# EAGLE design schemat (EAGLE 9.6.0)
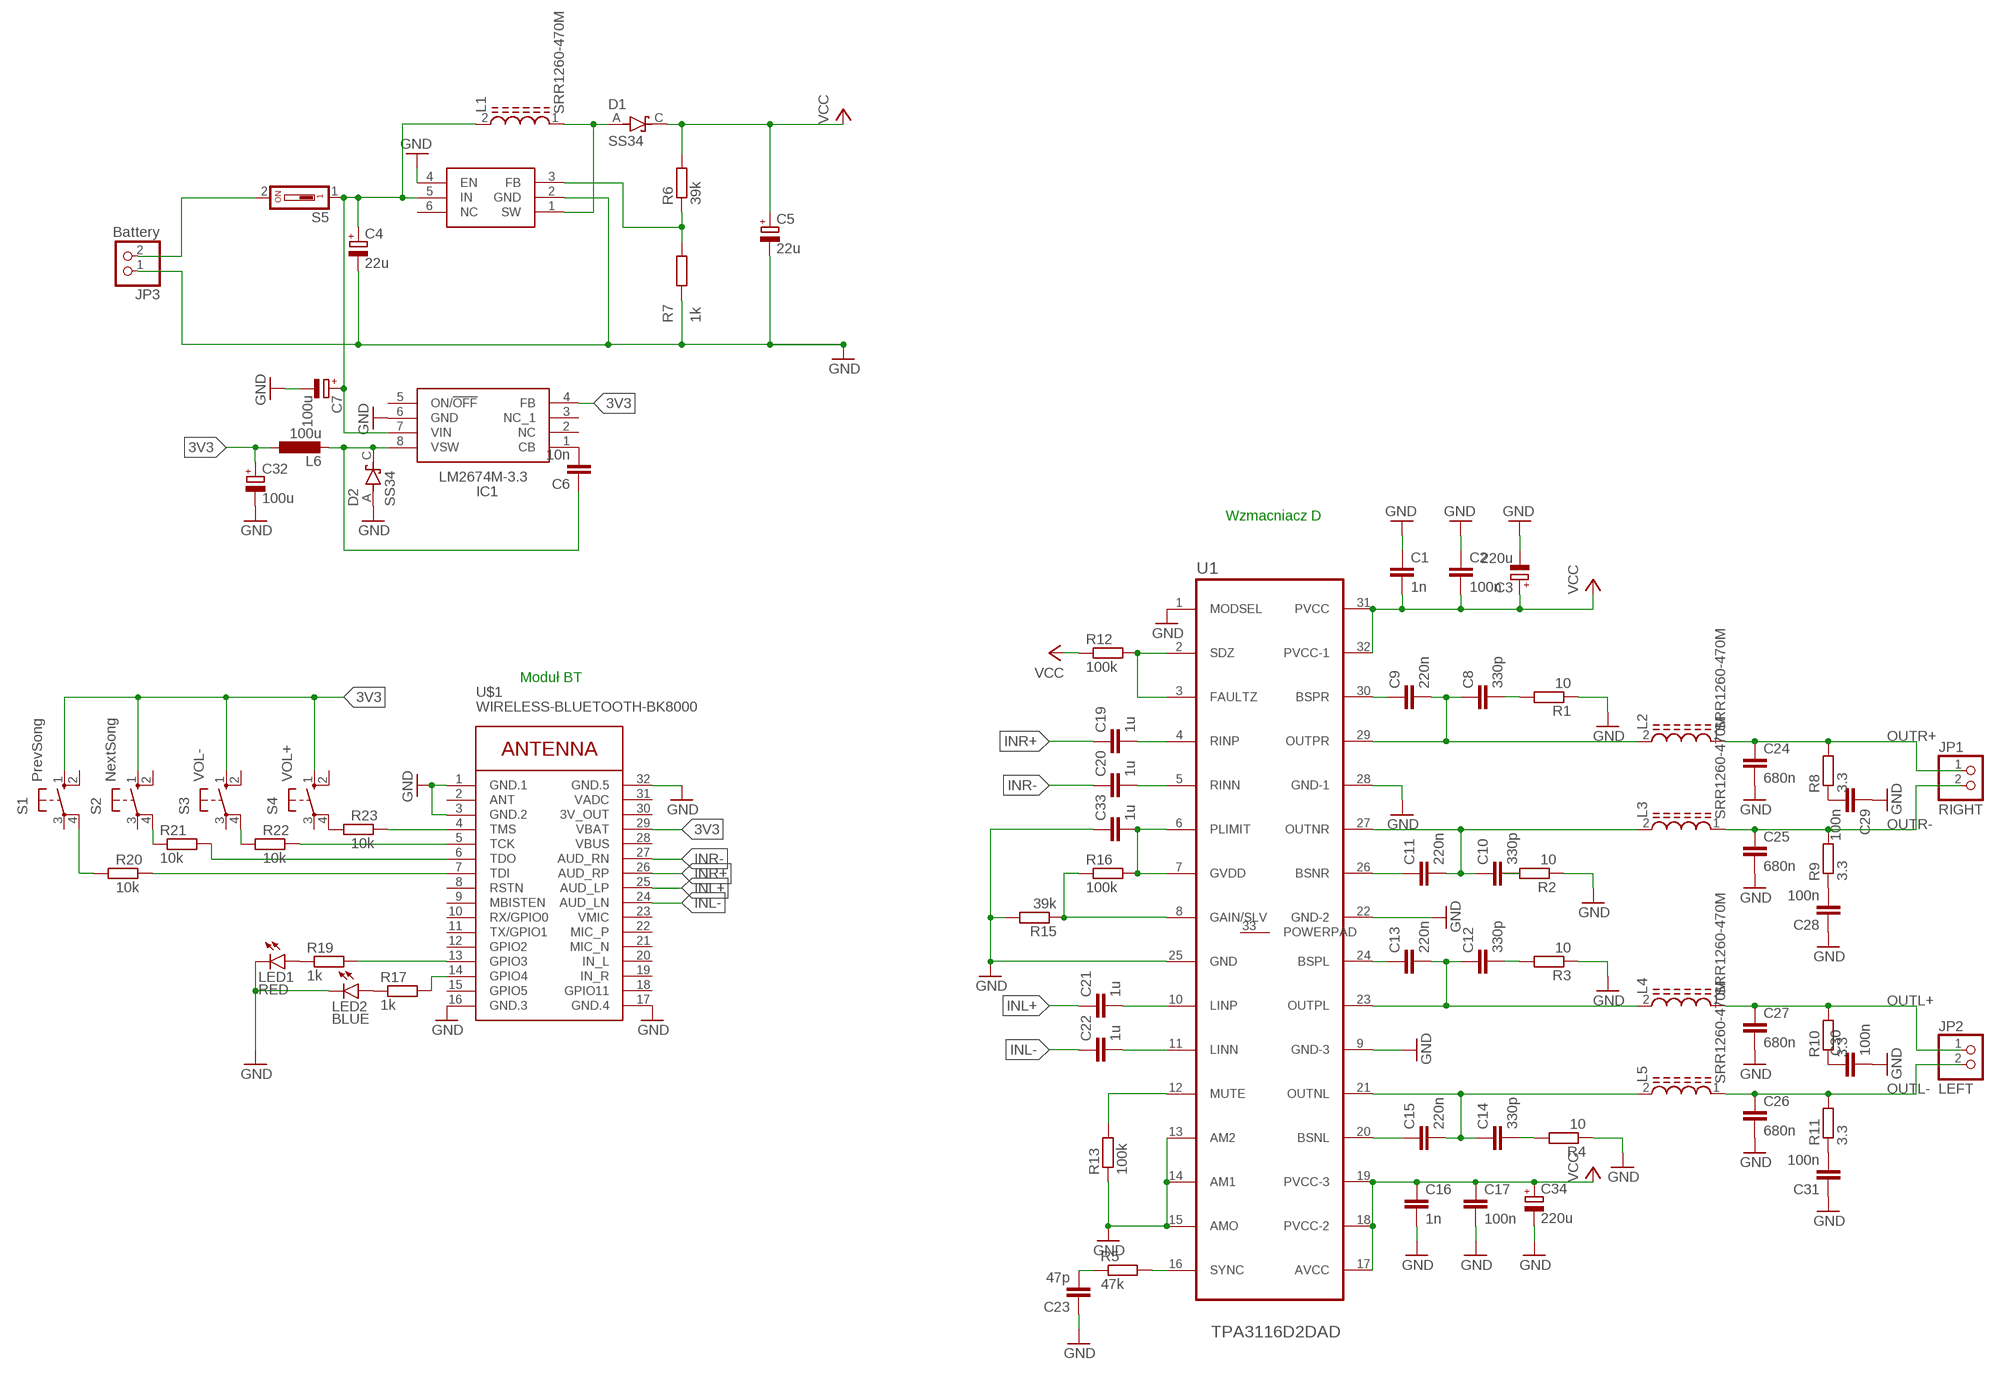
[diagram p0: schematic, sheet 1]

## Parts
C1  1n  C-EUC0805  [C0805]
C2  100n  C-EUC0805  [C0805]
C3  220u  CPOL-EU140CLH-0810  [140CLH-0810]
C4  22u  CPOL-EUD  [PANASONIC_D]
C5  22u  CPOL-EUD  [PANASONIC_D]
C6  10n  C-EUC0805  [C0805]
C7  100u  CPOL-EUD  [PANASONIC_D]
C8  330p  C-EUC0805  [C0805]
C9  220n  C-EUC0805  [C0805]
C10  330p  C-EUC0805  [C0805]
C11  220n  C-EUC0805  [C0805]
C12  330p  C-EUC0805  [C0805]
C13  220n  C-EUC0805  [C0805]
C14  330p  C-EUC0805  [C0805]
C15  220n  C-EUC0805  [C0805]
C16  1n  C-EUC0805  [C0805]
C17  100n  C-EUC0805  [C0805]
C19  1u  C-EUC0603  [C0603]
C20  1u  C-EUC0603  [C0603]
C21  1u  C-EUC0603  [C0603]
C22  1u  C-EUC0603  [C0603]
C23  47p  C-EUC0603  [C0603]
C24  680n  C-EUC1206  [C1206]
C25  680n  C-EUC1206  [C1206]
C26  680n  C-EUC1206  [C1206]
C27  680n  C-EUC1206  [C1206]
C28  100n  C-EUC0805  [C0805]
C29  100n  C-EUC0805  [C0805]
C30  100n  C-EUC0805  [C0805]
C31  100n  C-EUC0805  [C0805]
C32  100u  CPOL-EUD  [PANASONIC_D]
C33  1u  C-EUC0603  [C0603]
C34  220u  CPOL-EUD  [PANASONIC_D]
D1  SS34  [DIOM7959X265N]
D2  SS34  [DIOM7959X265N]
IC1  LM2674M-3.3  [SOIC127P600X175-8N]
JP1  RIGHT  PINHD-1X2  [1X02]
JP2  LEFT  PINHD-1X2  [1X02]
JP3  Battery  PINHD-1X2  [1X02]
L1  SRR1260-470M  [INDP125125X600N]
L2  SRR1260-470M  [INDP125125X600N]
L3  SRR1260-470M  [INDP125125X600N]
L4  SRR1260-470M  [INDP125125X600N]
L5  SRR1260-470M  [INDP125125X600N]
L6  100u  L-EUL1812  [L1812]
LED1  RED  LEDCHIP-LED0805  [CHIP-LED0805]
LED2  BLUE  LEDCHIP-LED0805  [CHIP-LED0805]
R1  10  R-EU_R0805  [R0805]
R2  10  R-EU_R0805  [R0805]
R3  10  R-EU_R0805  [R0805]
R4  10  R-EU_R0805  [R0805]
R5  47k  R-EU_R0603  [R0603]
R6  39k  R-EU_R0805  [R0805]
R7  1k  R-EU_R0805  [R0805]
R8  3.3  R-EU_R0603  [R0603]
R9  3.3  R-EU_R0603  [R0603]
R10  3.3  R-EU_R0603  [R0603]
R11  3.3  R-EU_R0603  [R0603]
R12  100k  R-EU_R0603  [R0603]
R13  100k  R-EU_R0805  [R0805]
R15  39k  R-EU_R0805  [R0805]
R16  100k  R-EU_R0805  [R0805]
R17  1k  R-EU_R0805  [R0805]
R19  1k  R-EU_R0805  [R0805]
R20  10k  R-EU_R0805  [R0805]
R21  10k  R-EU_R0805  [R0805]
R22  10k  R-EU_R0805  [R0805]
R23  10k  R-EU_R0805  [R0805]
S1  PrevSong  10-XX  [B3F-10XX]
S2  NextSong  10-XX  [B3F-10XX]
S3  VOL-  10-XX  [B3F-10XX]
S4  VOL+  10-XX  [B3F-10XX]
S5  DS01  [DS-01]
U1  TPA3116D2DAD  [SOP65P810X120-33N]
U2  MT3608  [SOT95P280X145-6N]
U$1  WIRELESS-BLUETOOTH-BK8000  [WIRELESS-BLUETOOTH-BK8000]

## Nets
3V3: C32.+ IC1.4(FB) L6.1 S1.1(S) S2.1(S) S3.1(S) S4.1(S) U$1.29(VBAT)
BAT+: C4.+ C7.+ IC1.7(VIN) L1.2 S5.1 U2.5(IN)
BAT-: C4.- C5.- JP3.1 R7.1 U2.2(GND) ; supply symbol labelled GND
GND: C1.1 C2.1 C3.- C7.- C16.2 C17.2 C23.1 C24.2 C25.2 C26.2 C27.2 C28.1 C29.1 C30.2 C31.1 C32.- C33.1 C34.- D2.A IC1.6(GND) LED1.C LED2.C R1.1 R2.1 R3.1 R4.1 R13.1 R15.2 U1.1(MODSEL) U1.9(GND-3) U1.13(AM2) U1.14(AM1) U1.15(AMO) U1.22(GND-2) U1.25(GND) U1.28(GND-1) U2.4(EN) U$1.1(GND.1) U$1.3(GND.2) U$1.16(GND.3) U$1.17(GND.4) U$1.32(GND.5)
INL+: C21.1 U$1.25(AUD_LP)
INL-: C22.1 U$1.24(AUD_LN)
INR+: C19.1 U$1.26(AUD_RP)
INR-: C20.1 U$1.27(AUD_RN)
N$1: D1.A L1.1 U2.1(SW)
N$2: C9.1 U1.30(BSPR)
N$3: C8.1 C9.2 L2.2 U1.29(OUTPR)
N$4: C12.1 C13.2 L4.2 U1.23(OUTPL)
N$5: C8.2 R1.2
N$6: C11.1 U1.26(BSNR)
N$7: C10.1 C11.2 L3.2 U1.27(OUTNR)
N$8: C10.2 R2.2
N$9: C13.1 U1.24(BSPL)
N$10: C15.1 U1.20(BSNL)
N$11: C12.2 R3.2
N$12: C14.2 R4.2
N$13: C6.1 D2.C(K) IC1.8(VSW) L6.2
N$14: R6.1 R7.2 U2.3(FB)
N$15: C19.2 U1.4(RINP)
N$16: C14.1 C15.2 L5.2 U1.21(OUTNL)
N$17: C20.2 U1.5(RINN)
N$18: C21.2 U1.10(LINP)
N$19: C22.2 U1.11(LINN)
N$20: C23.2 R5.1
N$21: R5.2 U1.16(SYNC)
N$22: R22.1 S3.4(P1)
N$23: LED2.A R17.1
N$24: LED1.A R19.1
N$25: R17.2 U$1.14(GPIO4)
N$26: C28.2 R9.1
N$27: C29.2 R8.1
N$28: C30.1 R10.1
N$29: C31.2 R11.1
N$30: R12.2 U1.2(SDZ) U1.3(FAULTZ)
N$31: R13.2 U1.12(MUTE)
N$32: C33.2 R16.2 U1.6(PLIMIT) U1.7(GVDD)
N$33: R19.2 U$1.13(GPIO3)
N$35: R15.1 R16.1 U1.8(GAIN/SLV)
N$36: C6.2 IC1.1(CB)
N$37: R21.1 S2.4(P1)
N$38: R20.2 U$1.7(TDI)
N$39: R21.2 U$1.6(TDO)
N$40: R20.1 S1.4(P1)
N$41: R23.1 S4.4(P1)
N$42: JP3.2 S5.2
N$43: R22.2 U$1.5(TCK)
N$44: R23.2 U$1.4(TMS)
OUTL+: C27.1 JP2.1 L4.1 R10.2
OUTL-: C26.1 JP2.2 L5.1 R11.2
OUTR+: C24.1 JP1.1 L2.1 R8.2
OUTR-: C25.1 JP1.2 L3.1 R9.2
VCC: C1.2 C2.2 C3.+ C5.+ C16.1 C17.1 C34.+ D1.C(K) R6.2 R12.1 U1.17(AVCC) U1.18(PVCC-2) U1.19(PVCC-3) U1.31(PVCC) U1.32(PVCC-1)
Unconnected: IC1.2(NC) IC1.3(NC_1) IC1.5(ON/!OFF) S1.2(S1) S1.3(P) S2.2(S1) S2.3(P) S3.2(S1) S3.3(P) S4.2(S1) S4.3(P) U1.33(POWERPAD) U2.6(NC) U$1.2(ANT) U$1.8(RSTN) U$1.9(MBISTEN) U$1.10(RX/GPIO0) U$1.11(TX/GPIO1) U$1.12(GPIO2) U$1.15(GPIO5) U$1.18(GPIO11) U$1.19(IN_R) U$1.20(IN_L) U$1.21(MIC_N) U$1.22(MIC_P) U$1.23(VMIC) U$1.28(VBUS)

## Notes on the sheet
- Wzmacniacz D
- Moduł BT

## Power pins joined to a net without a drawn wire
3V_OUT: U$1.30(3V_OUT)
VADC: U$1.31(VADC)

## Library data of the parts
C1 C2 C6 C8-C17 C19-C31 C33 = rcl:C-EU: CAPACITOR, European symbol; SPICEPREFIX: C
C3-C5 C7 C32 C34 = rcl:CPOL-EU: POLARIZED CAPACITOR, European symbol; SPICEPREFIX: C
D1 D2 = SS34:SS34: Diode Schottky 40V 3A 2-Pin SMC T/R; AVAILABILITY: Unavailable; DESCRIPTION: Diode Schottky 40V 3A Surface Mount SMC _DO-214AB_; MF: ON Semiconductor; MP: SS34; PACKAGE: DO-214AB-214 ON Semiconductor; PRICE: None
IC1 = LM2674M-3.3:LM2674M-3.3: Stepdown switching regulator,LM2674M-3.3 Source: Datasheet <http://www.ti.com/lit/ds/symlink/lm2674.pdf>; DESCRIPTION: Stepdown switching regulator,LM2674M-3.3; HEIGHT: 1.75mm; MANUFACTURER_NAME: Texas Instruments; MANUFACTURER_PART_NUMBER: LM2674M-3.3; MOUSER_PART_NUMBER: 926-LM2674M-33; MOUSER_PRICE-STOCK: https://www.mouser.com/Search/Refine.aspx?Keyword=926-LM2674M-33; RS_PART_NUMBER: 4699418; RS_PRICE-STOCK: http://uk.rs-online.com/web/p/products/4699418
JP1-JP3 = pinhead:PINHD-1X2: PIN HEADER
L1-L5 = SRR1260-470M:SRR1260-470M: Inductor Power Shielded Wirewound 33uH 20% 100KHz 27Q-Factor Ferrite 3A 60mOhm DCR T/R; AVAILABILITY: Unavailable; DESCRIPTION: 47µH Shielded Wirewound Inductor 2.6A 86mOhm Max Nonstandard; MF: Bourns; MP: SRR1260-470M; PACKAGE: Nonstandard Bourns; PRICE: None
L6 = rcl:L-EU: INDUCTOR, European symbol; SPICEPREFIX: L
LED1 LED2 = led:LED: LED OSRAM: - CHIPLED LG R971, LG N971, LY N971, LG Q971, LY Q971, LO R971, LY R971 LH N974, LH R974 LS Q976, LO Q976, LY Q976 LO Q996 - Hyper CHIPLED LW Q18S LB Q993, LB Q99A, LB R99A - SideLED LS A670, LO A670, LY A670, LG A670, LP A670 LB A673, LV A673, LT A673, LW A673 LH A674 LY A675 LS A676, LA A676, LO A676, LY A676, LW A676 LS A679, LY A679, LG A679 - Hyper Micro SIDELED® LS Y876, LA Y876, LO Y876, LY Y876 LT Y87S - SmartLED LW L88C, LW L88S LB L89C, LB L89S, LG L890 LS L89K, LO L89K, LY L89K LS L896, LA L896, LO L896, LY L896 - TOPLED LS T670, LO T670, LY T670, LG T670, LP T670 LSG T670, LSP T670, LSY T670, LOP T670, LYG T670 LG T671, LOG T671, LSG T671 LB T673, LV T673, LT T673, LW T673 LH T674 LS T676, LA T676, LO T676, LY T676, LB T676, LH T676, LSB T676, LW T676 LB T67C, LV T67C, LT T67C, LS T67K, LO T67K, LY T67K, LW E67C LS E67B, LA E67B, LO E67B, LY E67B, LB E67C, LV E67C, LT E67C LW T67C LS T679, LY T679, LG T679 LS T770, LO T770, LY T770, LG T770, LP T770 LB T773, LV T773, LT T773, LW T773 LH T774 LS E675, LA E675, LY E675, LS T675 LS T776, LA T776, LO T776, LY T776, LB T776 LHGB T686 LT T68C, LB T68C - Hyper Mini TOPLED® LB M676 - Mini TOPLED Santana® LG M470 LS M47K, LO M47K, LY M47K Source: http://www.osram.convergy.de LUXEON: - LUMILED® LXK2-PW12-R00, LXK2-PW12-S00, LXK2-PW14-U00, LXK2-PW14-V00 LXK2-PM12-R00, LXK2-PM12-S00, LXK2-PM14-U00 LXK2-PE12-Q00, LXK2-PE12-R00, LXK2-PE12-S00, LXK2-PE14-T00, LXK2-PE14-U00 LXK2-PB12-K00, LXK2-PB12-L00, LXK2-PB12-M00, LXK2-PB14-N00, LXK2-PB14-P00, LXK2-PB14-Q00 LXK2-PR12-L00, LXK2-PR12-M00, LXK2-PR14-Q00, LXK2-PR14-R00 LXK2-PD12-Q00, LXK2-PD12-R00, LXK2-PD12-S00 LXK2-PH12-R00, LXK2-PH12-S00 LXK2-PL12-P00, LXK2-PL12-Q00, LXK2-PL12-R00 Source: www.luxeon.com KINGBRIGHT: KA-3528ASYC Source: www.kingbright.com
R1-R13 R15-R17 R19-R23 = rcl:R-EU_: RESISTOR, European symbol; SPICEPREFIX: R
S1-S4 = switch-omron:10-XX: OMRON SWITCH; MPN: B3F-1000; OC_FARNELL: 176432; OC_NEWARK: 36M3542
S5 = switch-dil:DS01: DIL/CODE SWITCH; OC_FARNELL: unknown; OC_NEWARK: unknown
U1 = TPA3116D2DAD:TPA3116D2DAD: ￼TPA3116DAD by Daniel Nugent; AVAILABILITY: Unavailable; DESCRIPTION: Amplifier IC 2-Channel _Stereo_ Class D 32-HTSSOP; MF: Texas Instruments; MP: TPA3116D2DAD; PACKAGE: HTSSOP-32 Texas Instruments; PRICE: None
U2 = MT3608:MT3608: High Efficiency 1.2MHz 2A Step Up Converter Source: Datasheet <https://www.olimex.com/Products/Breadboarding/BB-PWR-3608/resources/MT3608.pdf>; DESCRIPTION: High Efficiency 1.2MHz 2A Step Up Converter; HEIGHT: 1.45mm; MANUFACTURER_NAME: Aerosemi; MANUFACTURER_PART_NUMBER: MT3608
U$1 = diy-modules:WIRELESS-BLUETOOTH-BK8000: Bluetooth Audio Module based on BK8000L chip More details available here: http://www.electrodragon.com/w/BK8000L Click here to find device on ebay.com <http://www.ebay.com/sch/bk8000l+module>

## Board
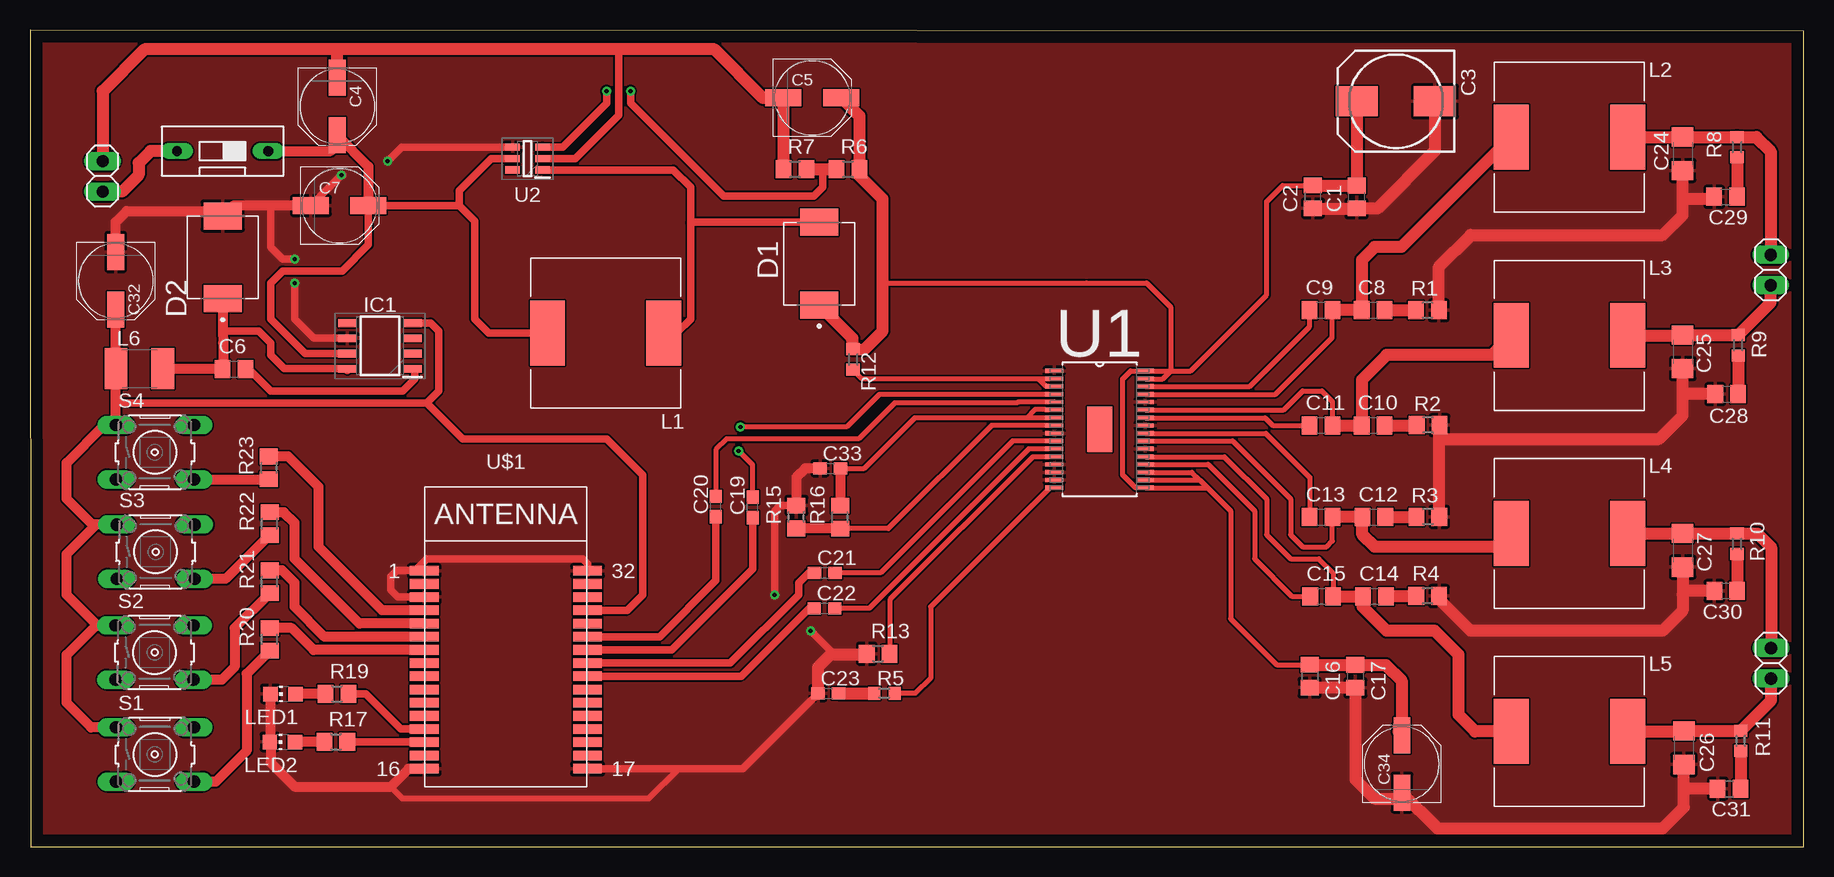
[diagram p1: board, top side]
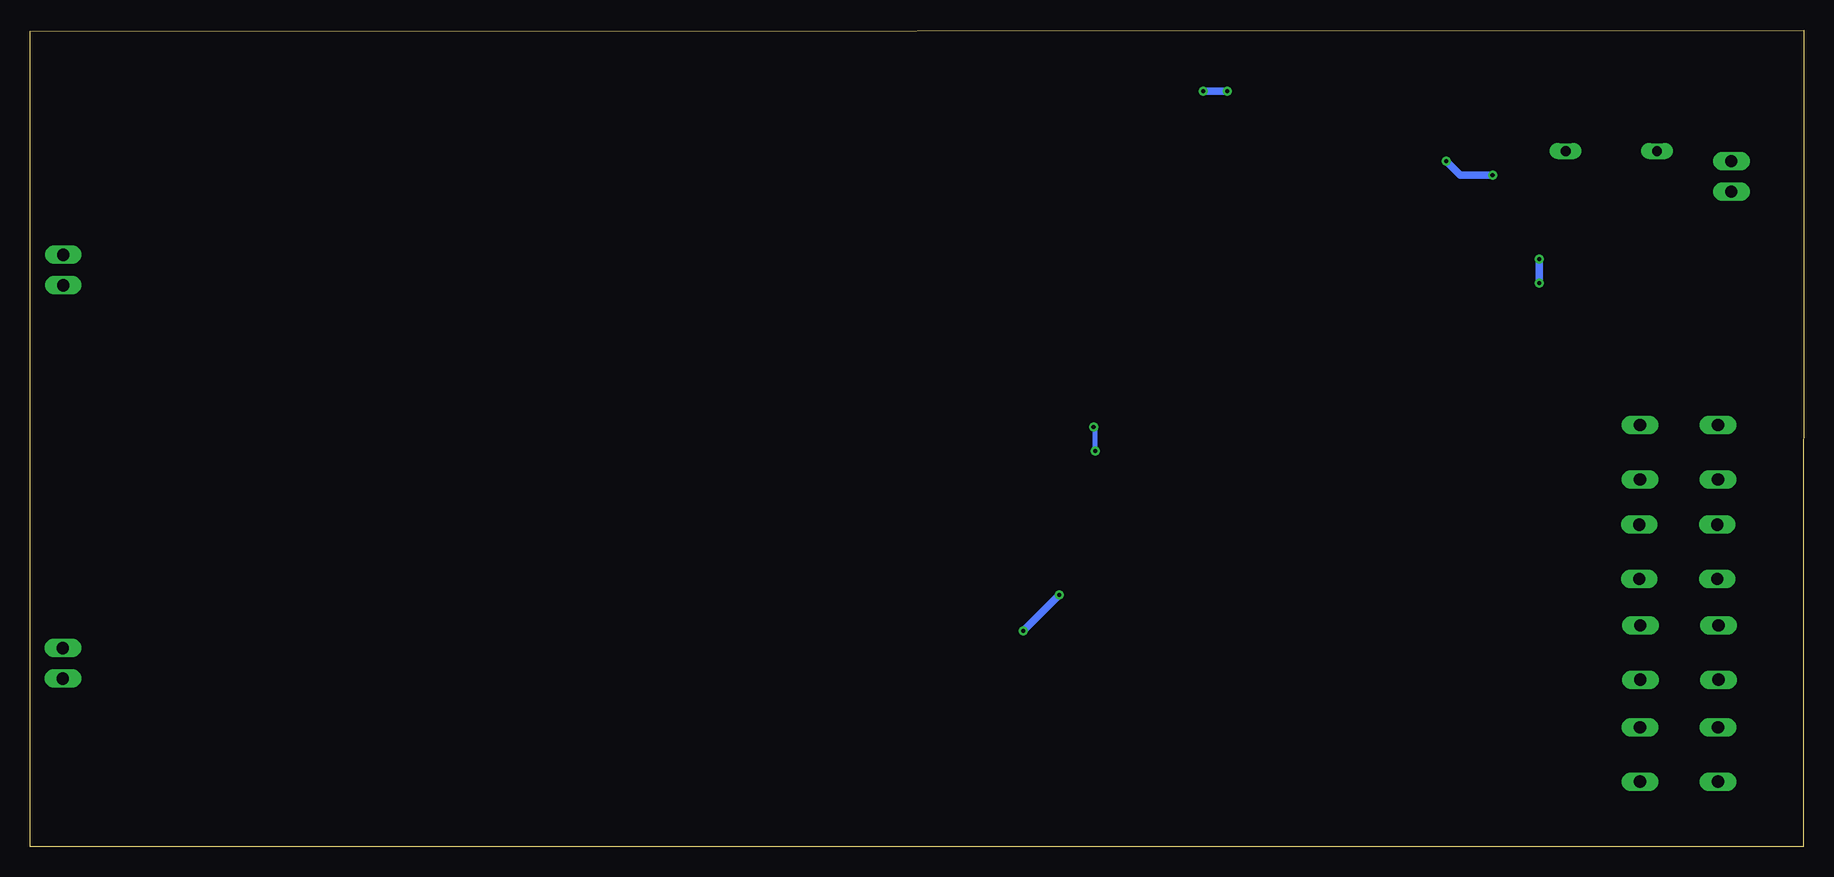
[diagram p2: board, bottom side, seen from below]

Size 147.83 x 68.1 mm. Coordinates in mm from the lower left corner, seen from the top.
Outline: 0.05,0 147.83,0 147.83,68 0,68.1 0.05,0
Copper layers (1*16): Top 0.035mm / dielectric 1.5mm / Bottom 0.035mm
Design rules "default": minimum track width 6mil, minimum drill 0.35mm, track to track 6mil, track to pad 6mil, pad to pad 6mil, via to via 6mil, smd to smd 6mil, copper to edge 40mil, drill to drill 6mil, minimum pad ring 10mil, minimum via ring 8mil, stop-mask expansion 4mil, vias tented up to drill 0mil, thermal gap 10mil

### Footprints (pad centres in the part's own frame; a part is rotated, then mirrored left to right if it is on the bottom)
C0805 = smd 1.3 x 1.5: 1 -0.95,0; 2 0.95,0
140CLH-0810 = smd 3.5 x 2.5: + 3.25,0; - -3.25,0
PANASONIC_D = smd 3 x 1.4: + 2.4,0; - -2.4,0
C0603 = smd 1.1 x 1: 1 -0.85,0; 2 0.85,0
C1206 = smd 1.6 x 1.8: 1 -1.4,0; 2 1.4,0
DIOM7959X265N = smd 2.25 x 3.18: A 3.455,0; C -3.455,0
SOIC127P600X175-8N = smd 1.525 x 0.65: 1 -2.712,1.905; 2 -2.712,0.635; 3 -2.712,-0.635; 4 -2.712,-1.905; 5 2.712,-1.905; 6 2.712,-0.635; 7 2.712,0.635; 8 2.712,1.905
1X02 = drill 1.016 long: 1 -1.27,0; 2 1.27,0
INDP125125X600N = smd 2.9 x 5.4: 1 -4.85,0; 2 4.85,0
L1812 = smd 1.9 x 3.4: 1 -1.95,0; 2 1.95,0
CHIP-LED0805 = smd 1.2 x 1.2: A 0,-1.05; C 0,1.05
R0805 = smd 1.3 x 1.5: 1 -0.95,0; 2 0.95,0
R0603 = smd 1 x 1.1: 1 -0.85,0; 2 0.85,0
B3F-10XX = drill 1.016 long: 1 -3.251,2.261; 2 3.251,2.261; 3 -3.251,-2.261; 4 3.251,-2.261
DS-01 = drill 0.813 long: 1 0,-3.81; 2 0,3.81
SOP65P810X120-33N = smd 1.473 x 0.356: 1 -3.785,4.877; 2 -3.785,4.216; 3 -3.785,3.581; 4 -3.785,2.921; 5 -3.785,2.286; 6 -3.785,1.626; 7 -3.785,0.965; 8 -3.785,0.33; 9 -3.785,-0.33; 10 -3.785,-0.965; 11 -3.785,-1.626; 12 -3.785,-2.286; 13 -3.785,-2.921; 14 -3.785,-3.581; 15 -3.785,-4.216; 16 -3.785,-4.877; 17 3.785,-4.877; 18 3.785,-4.216; 19 3.785,-3.581; 20 3.785,-2.921; 21 3.785,-2.286; 22 3.785,-1.626; 23 3.785,-0.965; 24 3.785,-0.33; 25 3.785,0.33; 26 3.785,0.965; 27 3.785,1.626; 28 3.785,2.286; 29 3.785,2.921; 30 3.785,3.581; 31 3.785,4.216; 32 3.785,4.877 | smd 2.108 x 3.81: 33 0,0
SOT95P280X145-6N = smd 1.2 x 0.6: 1 -1.25,0.95; 2 -1.25,0; 3 -1.25,-0.95; 4 1.25,-0.95; 5 1.25,0; 6 1.25,0.95
WIRELESS-BLUETOOTH-BK8000 = smd 2.4 x 0.8: 1 -6.8,5.5; 2 -6.8,4.4; 3 -6.8,3.3; 4 -6.8,2.2; 5 -6.8,1.1; 6 -6.8,0; 7 -6.8,-1.1; 8 -6.8,-2.2; 9 -6.8,-3.3; 10 -6.8,-4.4; 11 -6.8,-5.5; 12 -6.8,-6.6; 13 -6.8,-7.7; 14 -6.8,-8.8; 15 -6.8,-9.9; 16 -6.8,-11; 17 6.8,-11; 18 6.8,-9.9; 19 6.8,-8.8; 20 6.8,-7.7; 21 6.8,-6.6; 22 6.8,-5.5; 23 6.8,-4.4; 24 6.8,-3.3; 25 6.8,-2.2; 26 6.8,-1.1; 27 6.8,0; 28 6.8,1.1; 29 6.8,2.2; 30 6.8,3.3; 31 6.8,4.4; 32 6.8,5.5

### Placement (x,y rotation side)
C1  110.56,54.17 90 top
C2  106.91,54.18 90 top
C3  113.83,62.15 180 top
C4  25.6,61.72 270 top
C5  65.19,62.45 0 top
C6  17,39.84 0 top
C7  25.8,53.45 0 top
C8  111.93,44.74 0 top
C9  107.58,44.74 0 top
C10  111.93,35.14 0 top
C11  107.58,35.14 0 top
C12  111.99,27.49 0 top
C13  107.59,27.49 0 top
C14  112.04,20.89 0 top
C15  107.64,20.89 0 top
C16  106.64,14.22 270 top
C17  110.44,14.21 270 top
C19  60.21,28.29 90 top
C20  57.16,28.36 90 top
C21  66.23,22.84 0 top
C22  66.2,19.89 0 top
C23  66.52,12.79 0 top
C24  137.72,57.78 270 top
C25  137.72,41.27 270 top
C26  137.82,8.25 270 top
C27  137.72,24.71 270 top
C28  141.39,37.74 0 top
C29  141.29,54.19 0 top
C30  141.31,21.31 180 top
C31  141.59,4.84 0 top
C32  7.14,47.18 270 top
C33  66.69,31.54 0 top
C34  114.33,6.9 90 top
D1  65.76,48.62 90 top
D2  16.06,49.14 90 top
IC1  29.17,41.76 180 top
JP1  145.06,48.08 270 top
JP2  145.09,15.29 270 top
JP3  6.05,55.9 270 top
L1  47.97,42.82 180 top
L2  128.29,59.15 180 top
L3  128.29,42.64 180 top
L4  128.29,26.13 180 top
L5  128.29,9.62 180 top
L6  9.12,39.87 0 top
LED1  21.08,12.74 90 top
LED2  21.03,8.74 90 top
R1  116.46,44.73 180 top
R2  116.51,35.16 180 top
R3  116.49,27.51 180 top
R4  116.47,20.91 180 top
R5  71.2,12.79 0 top
R6  68.16,56.49 0 top
R7  63.75,56.49 0 top
R8  142.25,58.33 90 top
R9  142.35,41.82 90 top
R10  142.25,25.26 90 top
R11  142.56,8.83 90 top
R12  68.59,40.63 270 top
R13  70.68,16.09 0 top
R15  63.86,27.49 90 top
R16  67.51,27.48 90 top
R17  25.49,8.74 0 top
R19  25.59,12.74 0 top
R20  19.96,17.29 90 top
R21  19.96,22.09 90 top
R22  19.96,26.94 90 top
R23  19.91,31.59 90 top
S1  10.41,7.69 0 top
S2  10.38,16.19 0 top
S3  10.47,24.59 0 top
S4  10.41,32.89 0 top
S5  16.05,58 90 top
U1  89.14,34.8 0 top
U2  41.46,57.38 180 top
U$1  39.66,17.51 0 top

### Tracks (layer width: path | path; a pad name or v marks a point on that pad's centre or on a via)
3V3
  Top 0.61: IC1.4 33.38,43.66 34.05,43 34.05,38 33.05,37 | 33.05,37 7.16,37 | U$1.29 49.76,19.71 51.05,21 51.05,31 48.05,34 36.05,34 33.05,37
  Top 0.813: S1.1 5.1,9.95 3.05,12 3.05,16 5.55,18.5 7.08,18.5 S2.1 5.6,18.45 3.05,21 3.05,24.4 5.5,26.85 | S3.1 5.5,26.85 | 5.5,26.85 5.2,26.85 3.05,29 3.05,32 6.2,35.15 6.2,35.11 6.24,35.15 S4.1 7.16,37 L6.1 7.14,39.9 C32.+
BAT+
  Top 0.61: IC1.7 22.93,41.12 20.05,44 20.05,47 21.05,48 26,48 28.2,50.2 C7.+ 35.75,53.45 | L1.2 38.23,42.82 37.05,44 37.05,52.15 35.75,53.45 | U2.5 38.43,57.38 35.75,54.7 35.75,53.45
  Top 0.813: S5.1 25.05,58 25.6,58.55 C4.+ 28.2,56.72 C7.+
BAT-
  Top 0.61: U2.2 45.43,57.38 49.05,61 49.05,66.48
  Top 1.016: R7.1 C5.- 61.08,62.45 57.05,66.48 49.05,66.48 25.6,66.48 | C4.- 25.6,66.48 | 25.6,66.48 9.53,66.48 6.05,63 JP3.1
GND  (via drill 0.35)
  Top 0.508: 54.05,6.51 51.54,4 31.05,4 30.05,5
  Top 0.61: U$1.17 54.05,6.51 59.39,6.51 C23.1 | IC1.6 23.66,42.4 22.05,44 v22.05,47 | 20.05,53.45 20.05,50 21.05,49 v22.05,49 | R15.2 62.49,28.44 62.05,28 v62.05,21 | v65.05,18 66.7,16.35 66.7,16 | U$1.3 30.64,20.81 30.05,21.4 30.05,22.55 30.55,23.05 32,23.05 32.05,23 33.05,24 46.05,24 46.46,23.59 U$1.32 | U2.4 30.98,58.33 v29.8,57.15 | C7.- v25.95,56 26.05,56
  Top 0.813: C33.1 64.59,31.54 63.86,30.81 R15.2 | LED1.C 20.03,8.79 LED2.C 20.05,8.67 20.05,7 22.05,5 30.05,5 31.56,6.51 U$1.16 | 23.25,53.6 C7.- 20.05,53.45 16.91,53.45 D2.A 15.66,53 8.05,53 7.14,52.09 C32.-
  Top 1.016: 137.74,23.31 C27.2 137.72,21 | 137.82,6.23 C26.2 137.82,5 | C2.1 C1.1 112.27,53.22 117.08,58.03 C3.- | C16.2 C17.2 110.44,5.61 112.05,4 113.83,4 C34.- 117.31,1.52 136.05,1.52 137.82,3.29 137.82,5 | R13.1 69.64,16 66.7,16 65.65,14.95 65.65,12.81 C23.1 | 137.72,21 137.72,19.67 136.05,18 120.05,18 117.42,20.63 R4.1 | C30.2 138.03,21.31 137.72,21 | R3.1 117.44,34 | 117.44,34 117.44,35.14 R2.1 | 117.44,34 135.75,34 137.72,35.97 137.72,38 | 137.72,38 C25.2 | C28.1 137.98,37.74 137.72,38 | R1.1 117.41,48.36 120.05,51 136.05,51 137.72,52.67 137.72,54 | 137.72,54 C24.2 | C29.1 140.15,54 137.72,54 | C31.1 137.98,4.84 137.82,5
  Bottom 0.61: v62.05,21 v65.05,18 | v22.05,49 v22.05,47 | v29.8,57.15 28.65,56 v25.95,56
  pour Top: 0.05,68 148.05,68 148.05,0 0.05,0
INL+
  Top 0.61: U$1.25 58.36,15.31 64.05,21 64.05,22 64.89,22.84 C21.1
INL-
  Top 0.61: U$1.24 59.26,14.21 64.94,19.89 C22.1
INR+
  Top 0.61: U$1.26 53.46,16.41 60.21,23.16 C19.1
INR-
  Top 0.61: U$1.27 52.46,17.51 57.16,22.21 C20.1 57.05,27.4
N$1
  Top 0.61: 65.41,52.43 D1.A 55.12,52.08 55.05,52 | U2.1 53.62,56.43 55.05,55 55.05,52 | L1.1 53.87,42.82 55.05,44 55.05,52
N$2
  Top 0.406: U1.30 101.63,38.38 106.63,43.38 C9.1
N$3
  Top 0.406: U1.29 103.77,37.72 108.5,42.45 108.5,44.71 C9.2
  Top 1.016: L2.2 114.29,50 112.05,50 110.98,48.93 C8.1 C9.2
N$4
  Top 0.406: U1.23 100.22,33.84 105.05,29 105.05,26 106.05,25 108.05,25 108.54,25.49 C13.2
  Top 1.016: L4.2 122.31,25 112.05,25 111.04,26.01 C12.1 C13.2
N$5
  Top 1.016: C8.2 R1.2
N$6
  Top 0.406: U1.26 102.94,35.77 103.56,35.14 C11.1
N$7
  Top 0.406: U1.27 104.48,36.43 106.05,38 107.65,38 108.53,37.12 C11.2
  Top 1.016: L3.2 121.8,41 113.05,41 110.98,38.93 C10.1 C11.2
N$8
  Top 1.016: C10.2 115.54,35.14 R2.2
N$9
  Top 0.406: U1.24 102.98,34.47 106.65,30.8 C13.1
N$10
  Top 0.406: U1.20 98.17,31.88 102.05,28 102.05,24 105.16,20.89 C15.1
N$11
  Top 1.016: C12.2 115.52,27.49 R3.2
N$12
  Top 1.016: C14.2 113.01,20.91 R4.2
N$13
  Top 0.61: 26.46,39.71 IC1.8 21.2,39.85 20.05,41 20.05,42 19.05,43 16.08,43
  Top 0.813: L6.2 16.02,39.87 | 16.02,39.87 C6.1 | D2.C 16.08,43 16.09,42 16.09,39.94 16.02,39.87
N$14  (via drill 0.35)
  Top 0.61: 66.05,56.49 66.05,55 65.3,54.25 57.8,54.25 50.05,62 v50.05,63 | U2.3 44.38,58.33 48.05,62 v48.05,63
  Top 1.016: R7.2 66.05,56.49 R6.1
  Bottom 0.61: v48.05,63 v50.05,63
N$15  (via drill 0.35)
  Top 0.406: U1.4 70.77,37.72 68.05,35 v59.2,35 | C19.2 60.21,31.84 v59.05,33
  Bottom 0.406: v59.05,33 59.05,34.85 v59.2,35
N$16
  Top 0.406: U1.21 99.54,32.51 103.05,29 103.05,26 105.05,24 107.4,24 108.59,22.81 C15.2
  Top 1.016: L5.2 120.43,9.62 119.05,11 119.05,16 117.05,18 113.05,18 111.05,20 111.05,20.85 | 111.05,20.85 C14.1 | C15.2 111.01,20.89 111.05,20.85
N$17
  Top 0.406: U1.5 82.36,37.09 82.27,37 72.05,37 69.05,34 58.05,34 57.16,33.11 C20.2
N$18
  Top 0.406: U1.10 81.88,33.84 70.89,22.84 C21.2
N$19
  Top 0.406: U1.11 83.22,33.17 69.94,19.89 C22.2
N$20
  Top 1.016: C23.2 R5.1
N$21
  Top 0.406: U1.16 84.97,29.92 75.05,20 75.05,14.05 73.79,12.79 R5.2
N$22
  Top 0.813: R22.1 16.3,22.33 S3.4
N$23
  Top 0.813: R17.1 LED2.A
N$24
  Top 0.813: R19.1 LED1.A
N$25
  Top 0.61: R17.2 32.83,8.74 U$1.14
N$26
  Top 1.016: R9.1 C28.2
N$27
  Top 1.016: R8.1 C29.2
N$28
  Top 1.016: R10.1 C30.1
N$29
  Top 1.016: R11.1 142.56,4.86 C31.2
N$30
  Top 0.406: U1.2 84.05,39.02 | 84.05,39.02 69.35,39.02 R12.2 | U1.3 84.69,38.38 84.05,39.02
N$31
  Top 0.406: U1.12 83.56,32.51 71.65,20.6 71.65,16.11 R13.2
N$32
  Top 0.406: U1.7 83.05,35.77 | 83.05,35.77 73.72,35.77 69.46,31.51 67.51,31.51 | U1.6 84.62,36.43 84.61,36.44 83.73,36.44 83.05,35.77
  Top 0.813: C33.2 67.51,31.51 R16.2
N$33
  Top 0.61: U$1.13 30.89,9.81 27.96,12.74 R19.2
N$35
  Top 0.406: U1.8 80.13,35.13 71.53,26.53 R16.1
  Top 0.813: R16.1 R15.1
N$36
  Top 0.61: C6.2 18.21,39.84 20.05,38 31.05,38 32.05,39 32.05,39.69 IC1.1
N$37
  Top 0.813: R21.1 17.05,18.23 17.05,15 15.98,13.93 S2.4
N$38
  Top 0.813: U$1.7 23.64,16.41 21.81,18.24 R20.2
N$39
  Top 0.813: U$1.6 24.54,17.51 22.05,20 22.05,22 21.01,23.04 R21.2
N$40
  Top 0.813: R20.1 18.05,14.43 18.05,8 15.48,5.43 S1.4
N$41
  Top 0.813: S4.4 19.9,30.63 R23.1
N$42
  Top 1.016: S5.2 10.05,58 9.05,57 9.05,56 7.68,54.63 JP3.2
N$43
  Top 0.813: U$1.5 27.44,18.61 22.05,24 22.05,27 21.16,27.89 R22.2
N$44
  Top 0.813: U$1.4 29.34,19.71 24.05,25 24.05,30 21.51,32.54 R23.2
OUTL+
  Top 1.016: L4.1 137.7,26.13 C27.1 R10.2 143.94,26.11 145.09,24.96 JP2.1
OUTL-
  Top 1.016: L5.1 137.79,9.62 C26.1 137.85,9.68 R11.2 145.09,12.21 JP2.2
OUTR+
  Top 1.016: L2.1 137.69,59.15 C24.1 R8.2 143.87,59.18 145.06,57.99 JP1.1
OUTR-
  Top 1.016: L3.1 137.69,42.64 C25.1 R9.2 145.06,45.38 JP1.2
VCC
  Top 0.406: 95.05,39.68 93.05,39.68 U1.32 91.73,39.68 91.05,39 91.05,31 92.13,29.92 U1.17 98.13,29.92 | 95.05,39.68 96.73,39.68 103.05,46 103.05,53.8 104.38,55.13 C2.2 | 98.13,29.92 100.05,28 100.05,19 103.88,15.17 C16.1 | U1.31 94.39,39.02 95.05,39.68 | U1.19 96.83,31.22 97.47,30.58 | 97.47,30.58 98.13,29.92 | U1.18 97.47,30.58 | 71.05,47 88.05,47 93.05,47 95.05,45 95.05,39.68
  Top 1.016: C2.2 C1.2 | C1.2 | C3.+ 110.58,55.16 C1.2 | C16.1 C17.1 112.99,15.16 114.3,13.85 114.3,10.25 114.05,10 114.05,9.58 C34.+ | D1.C 68.53,42.4 R12.1 69.51,41.46 71.05,43 71.05,47 71.05,54 69.11,55.94 R6.2 69.11,60.93 C5.+